# EAGLE design Syno_Ver2.0 (EAGLE 9.5.2)
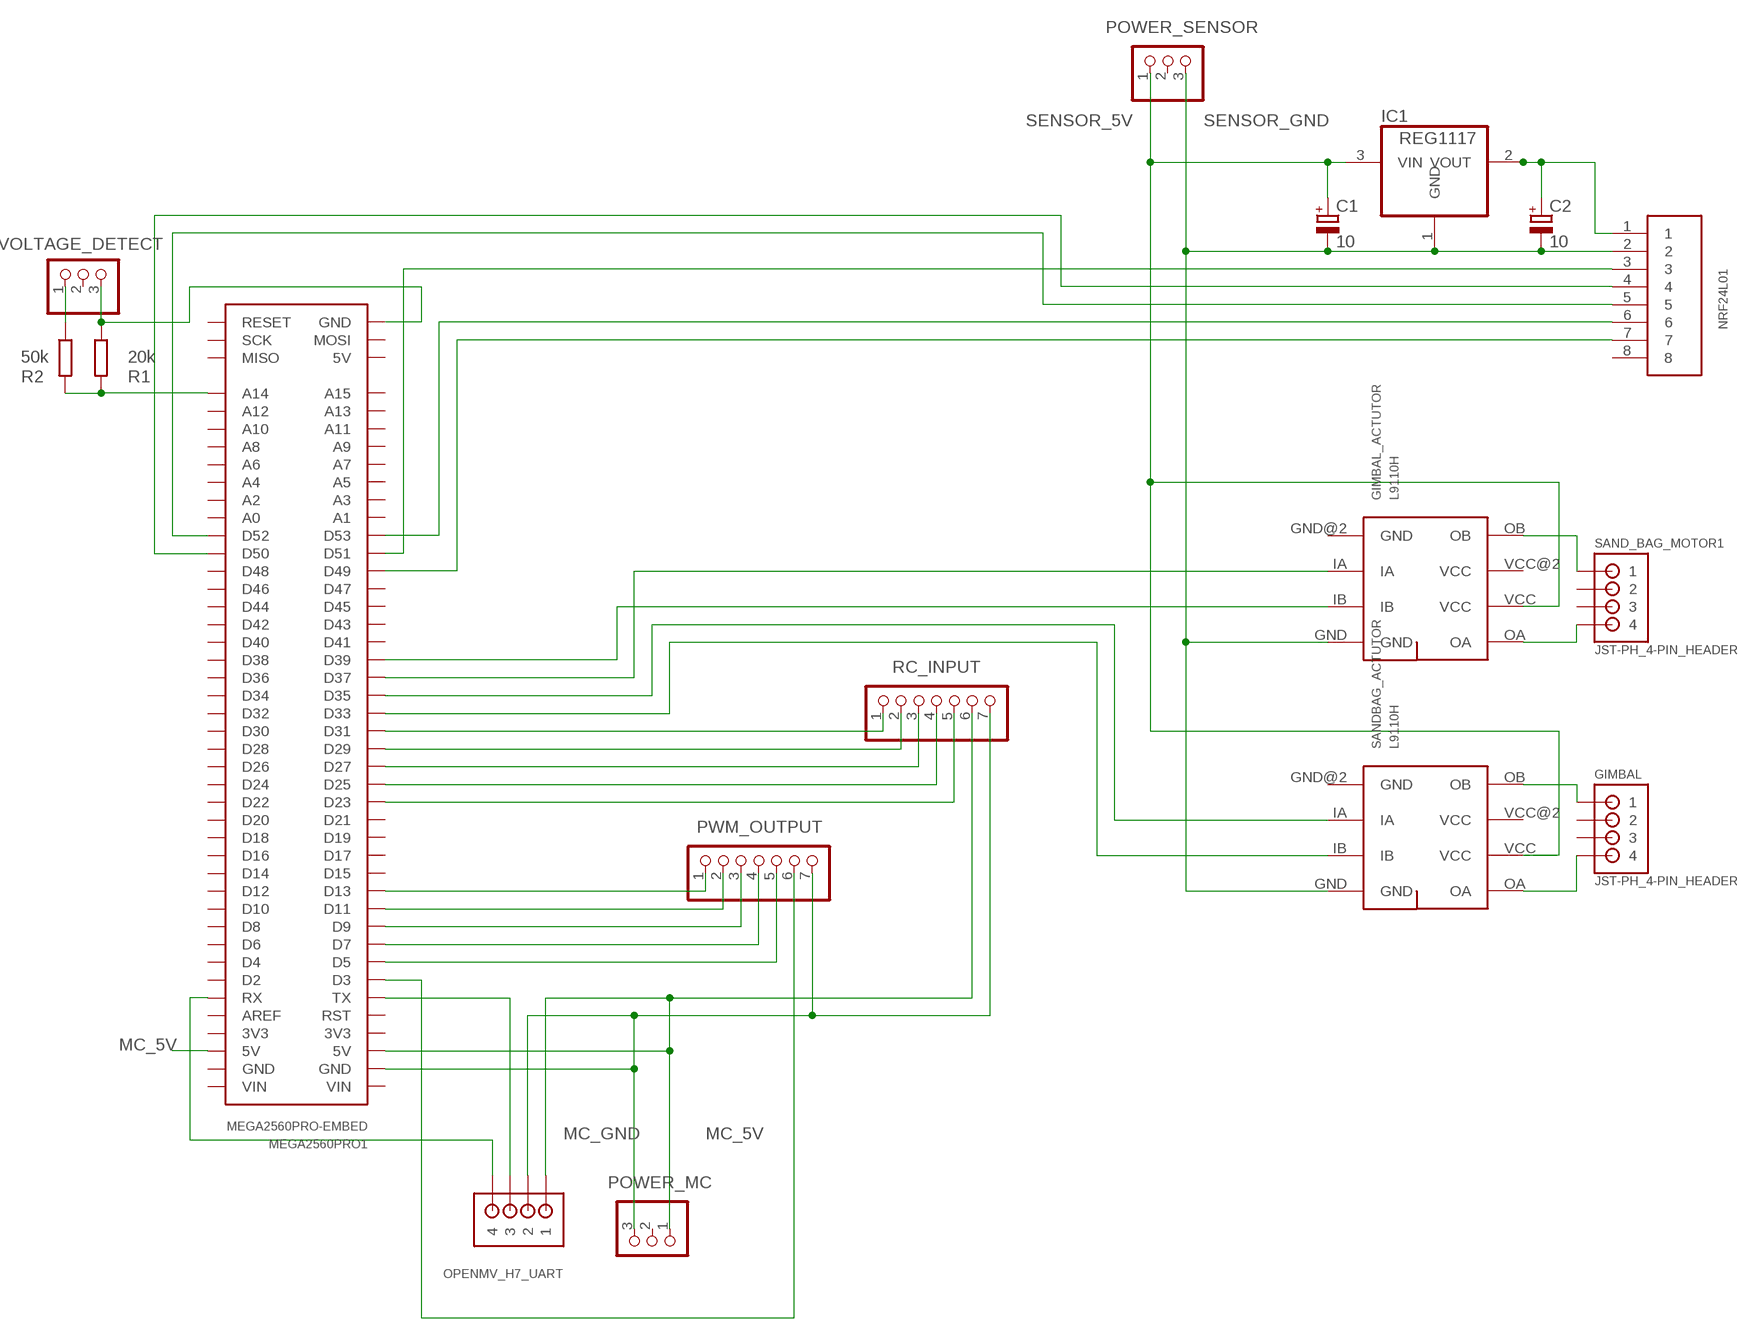
[diagram p0: schematic, sheet 1]

## Parts
C1  10  CPOL-EUE1.8-4  [E1,8-4]
C2  10  CPOL-EUE1.8-4  [E1,8-4]
GIMBAL  JST-PH_4-PIN_HEADER  [JST_B4B-PH_HEADER]
GIMBAL_ACTUTOR  L9110H  [L9110H]
IC1  REG1117  [SOT223]
MEGA2560PRO1  MEGA2560PRO-EMBED  [MEGA2560PRO-EMBED]
NRF24L01  8PIN  [B8B-PH-K-S]
OPENMV_H7_UART  JST-PH_4-PIN_HEADER  [JST_B4B-PH_HEADER]
POWER_MC  PINHD-1X3/90  [1X03/90]
POWER_SENSOR  PINHD-1X3/90  [1X03/90]
PWM_OUTPUT  PINHD-1X7/90  [1X07/90]
R1  20k  R-EU_0204/5  [0204/5]
R2  50k  R-EU_0204/5  [0204/5]
RC_INPUT  PINHD-1X7/90  [1X07/90]
SAND_BAG_MOTOR1  JST-PH_4-PIN_HEADER  [JST_B4B-PH_HEADER]
SANDBAG_ACTUTOR  L9110H  [L9110H]
VOLTAGE_DETECT  PINHD-1X3/90  [1X03/90]

## Nets
MC_5V: MEGA2560PRO1.5V@1(5V) MEGA2560PRO1.5V@2(5V) OPENMV_H7_UART.P1 POWER_MC.1 RC_INPUT.6
MC_GND: MEGA2560PRO1.GND@1(GND) OPENMV_H7_UART.P2 POWER_MC.3 PWM_OUTPUT.7 RC_INPUT.7
N$1: GIMBAL_ACTUTOR.OB SAND_BAG_MOTOR1.P1
N$2: GIMBAL_ACTUTOR.OA SAND_BAG_MOTOR1.P4
N$3: C2.+ IC1.2(VOUT) NRF24L01.1
N$4: GIMBAL.P1 SANDBAG_ACTUTOR.OB
N$5: GIMBAL.P4 SANDBAG_ACTUTOR.OA
N$6: R2.1 VOLTAGE_DETECT.1
N$7: MEGA2560PRO1.A14 R1.2 R2.2
N$8: MEGA2560PRO1.GND@3(GND) R1.1 VOLTAGE_DETECT.3
N$9: MEGA2560PRO1.TX OPENMV_H7_UART.P3
N$10: MEGA2560PRO1.RX OPENMV_H7_UART.P4
N$11: MEGA2560PRO1.D51 NRF24L01.3
N$12: MEGA2560PRO1.D50 NRF24L01.4
N$13: MEGA2560PRO1.D52 NRF24L01.5
N$14: MEGA2560PRO1.D3 PWM_OUTPUT.6
N$15: MEGA2560PRO1.D5 PWM_OUTPUT.5
N$16: MEGA2560PRO1.D7 PWM_OUTPUT.4
N$17: MEGA2560PRO1.D9 PWM_OUTPUT.3
N$18: MEGA2560PRO1.D11 PWM_OUTPUT.2
N$19: MEGA2560PRO1.D13 PWM_OUTPUT.1
N$20: MEGA2560PRO1.D23 RC_INPUT.5
N$21: MEGA2560PRO1.D25 RC_INPUT.4
N$22: MEGA2560PRO1.D27 RC_INPUT.3
N$23: MEGA2560PRO1.D29 RC_INPUT.2
N$24: MEGA2560PRO1.D31 RC_INPUT.1
N$25: MEGA2560PRO1.D53 NRF24L01.6
N$26: MEGA2560PRO1.D49 NRF24L01.7
N$27: GIMBAL_ACTUTOR.IA MEGA2560PRO1.D37
N$28: GIMBAL_ACTUTOR.IB MEGA2560PRO1.D39
N$29: MEGA2560PRO1.D35 SANDBAG_ACTUTOR.IA
N$30: MEGA2560PRO1.D33 SANDBAG_ACTUTOR.IB
SENSOR_5V: C1.+ GIMBAL_ACTUTOR.VCC IC1.3(VIN) POWER_SENSOR.1 SANDBAG_ACTUTOR.VCC
SENSOR_GND: C1.- C2.- GIMBAL_ACTUTOR.GND IC1.1(GND) NRF24L01.2 POWER_SENSOR.3 SANDBAG_ACTUTOR.GND
Unconnected: GIMBAL.P2 GIMBAL.P3 MEGA2560PRO1.3V3@1(3V3) MEGA2560PRO1.3V3@2(3V3) MEGA2560PRO1.5V@3(5V) MEGA2560PRO1.A0 MEGA2560PRO1.A1 MEGA2560PRO1.A2 MEGA2560PRO1.A3 MEGA2560PRO1.A4 MEGA2560PRO1.A5 MEGA2560PRO1.A6 MEGA2560PRO1.A7 MEGA2560PRO1.A8 MEGA2560PRO1.A9 MEGA2560PRO1.A10 MEGA2560PRO1.A11 MEGA2560PRO1.A12 MEGA2560PRO1.A13 MEGA2560PRO1.A15 MEGA2560PRO1.AREF MEGA2560PRO1.D2 MEGA2560PRO1.D4 MEGA2560PRO1.D6 MEGA2560PRO1.D8 MEGA2560PRO1.D10 MEGA2560PRO1.D12 MEGA2560PRO1.D14 MEGA2560PRO1.D15 MEGA2560PRO1.D16 MEGA2560PRO1.D17 MEGA2560PRO1.D18 MEGA2560PRO1.D19 MEGA2560PRO1.D20 MEGA2560PRO1.D21 MEGA2560PRO1.D22 MEGA2560PRO1.D24 MEGA2560PRO1.D26 MEGA2560PRO1.D28 MEGA2560PRO1.D30 MEGA2560PRO1.D32 MEGA2560PRO1.D34 MEGA2560PRO1.D36 MEGA2560PRO1.D38 MEGA2560PRO1.D40 MEGA2560PRO1.D41 MEGA2560PRO1.D42 MEGA2560PRO1.D43 MEGA2560PRO1.D44 MEGA2560PRO1.D45 MEGA2560PRO1.D46 MEGA2560PRO1.D47 MEGA2560PRO1.D48 MEGA2560PRO1.GND@2(GND) MEGA2560PRO1.MISO MEGA2560PRO1.MOSI MEGA2560PRO1.RESET MEGA2560PRO1.RST MEGA2560PRO1.SCK MEGA2560PRO1.VIN@1(VIN) MEGA2560PRO1.VIN@2(VIN) NRF24L01.8 POWER_MC.2 POWER_SENSOR.2 SAND_BAG_MOTOR1.P2 SAND_BAG_MOTOR1.P3 VOLTAGE_DETECT.2

## Power pins joined to a net without a drawn wire
GND: GIMBAL_ACTUTOR.GND@2(GND) SANDBAG_ACTUTOR.GND@2(GND)
VCC: GIMBAL_ACTUTOR.VCC@2(VCC) SANDBAG_ACTUTOR.VCC@2(VCC)

## Library data of the parts
C1 C2 = rcl:CPOL-EU: POLARIZED CAPACITOR, European symbol; SPICEPREFIX: C
GIMBAL OPENMV_H7_UART SAND_BAG_MOTOR1 = srg:JST-PH_4-PIN_HEADER: 4-pin JST PH Shrouded Header, top entry P/N B4B-PH-K-S Mating connector PHR-4 Mating cable assembly: Sparkfun PRT-09916 <http://www.sparkfun.com/products/9916>
GIMBAL_ACTUTOR SANDBAG_ACTUTOR = L9110:L9110H: H bridge ic
IC1 = burr-brown:REG1117: 800mA and 1A Low Dropout (LDO) Positive Regulator 1.8V, 2.5V, 2.85V, 3.3V, 5V, and Adj; MPN: REG1117; OC_FARNELL: 1097566; OC_NEWARK: 14P6981
MEGA2560PRO1 = robotdyn:MEGA2560PRO-EMBED: Robotdyn Robotdyn Mega 2560 PRO (Embed) https://robotdyn.com/mega-2560-pro-embed-ch340g-atmega2560-16au.html
NRF24L01 = jst_eph:8PIN
POWER_MC POWER_SENSOR VOLTAGE_DETECT = pinhead:PINHD-1X3: PIN HEADER
PWM_OUTPUT RC_INPUT = pinhead:PINHD-1X7: PIN HEADER
R1 R2 = rcl:R-EU_: RESISTOR, European symbol; SPICEPREFIX: R

## Board
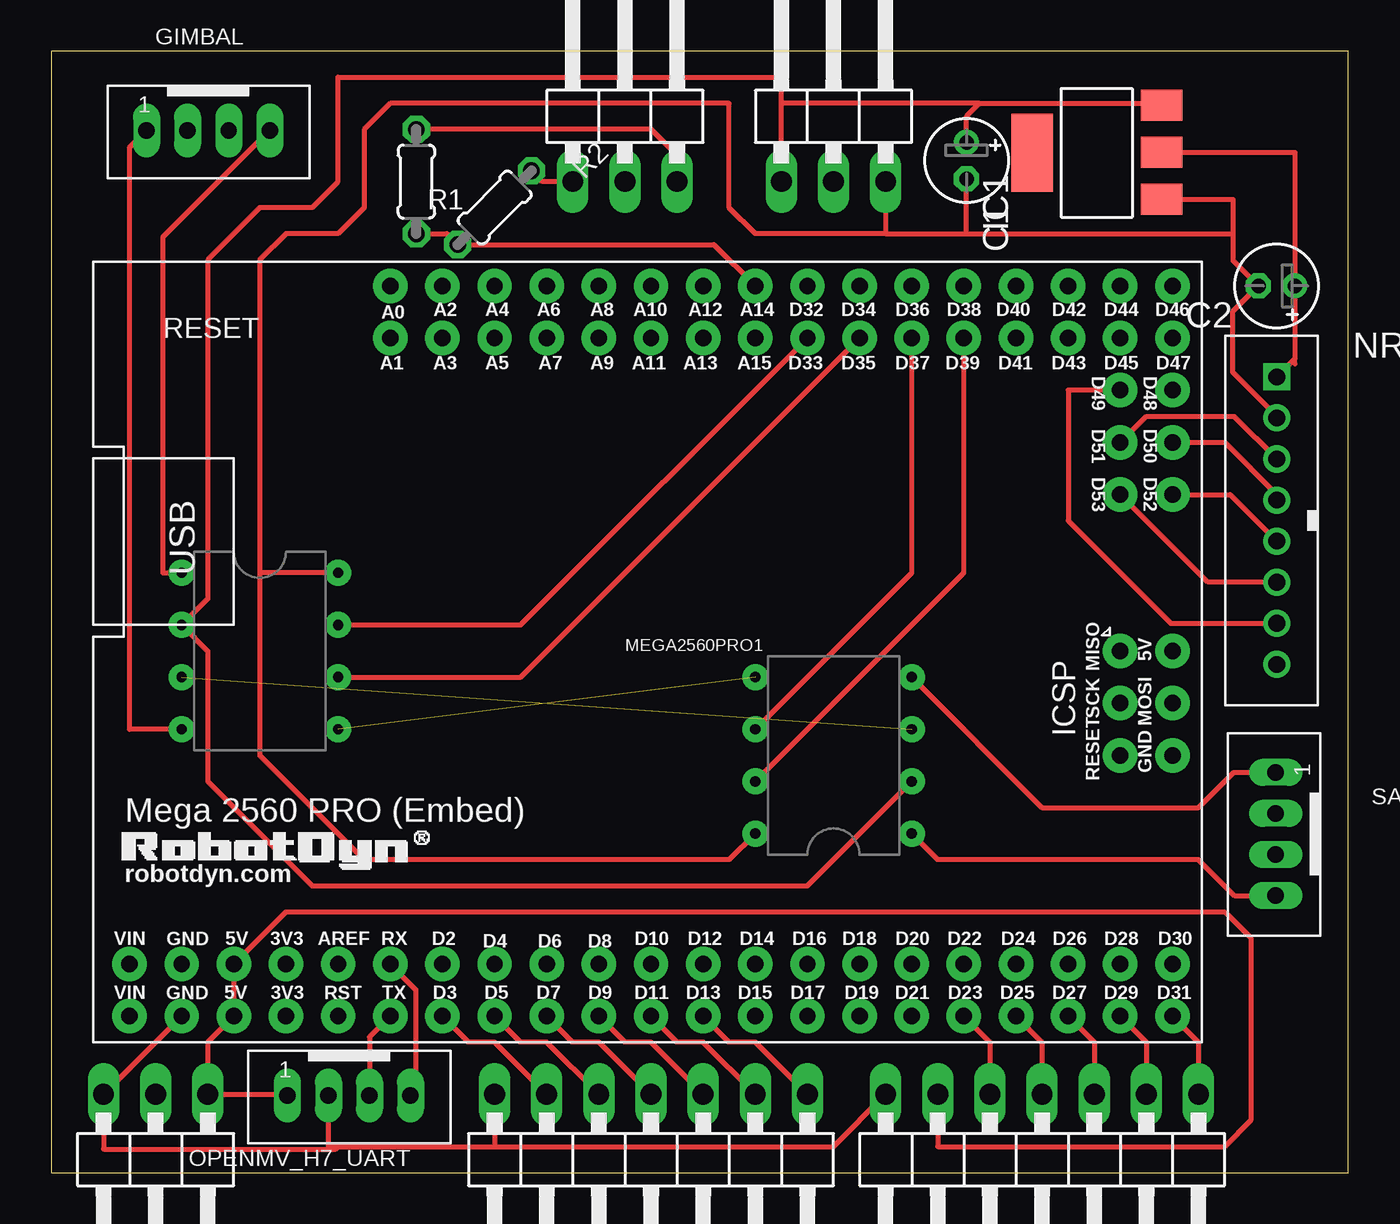
[diagram p1: board, top side]
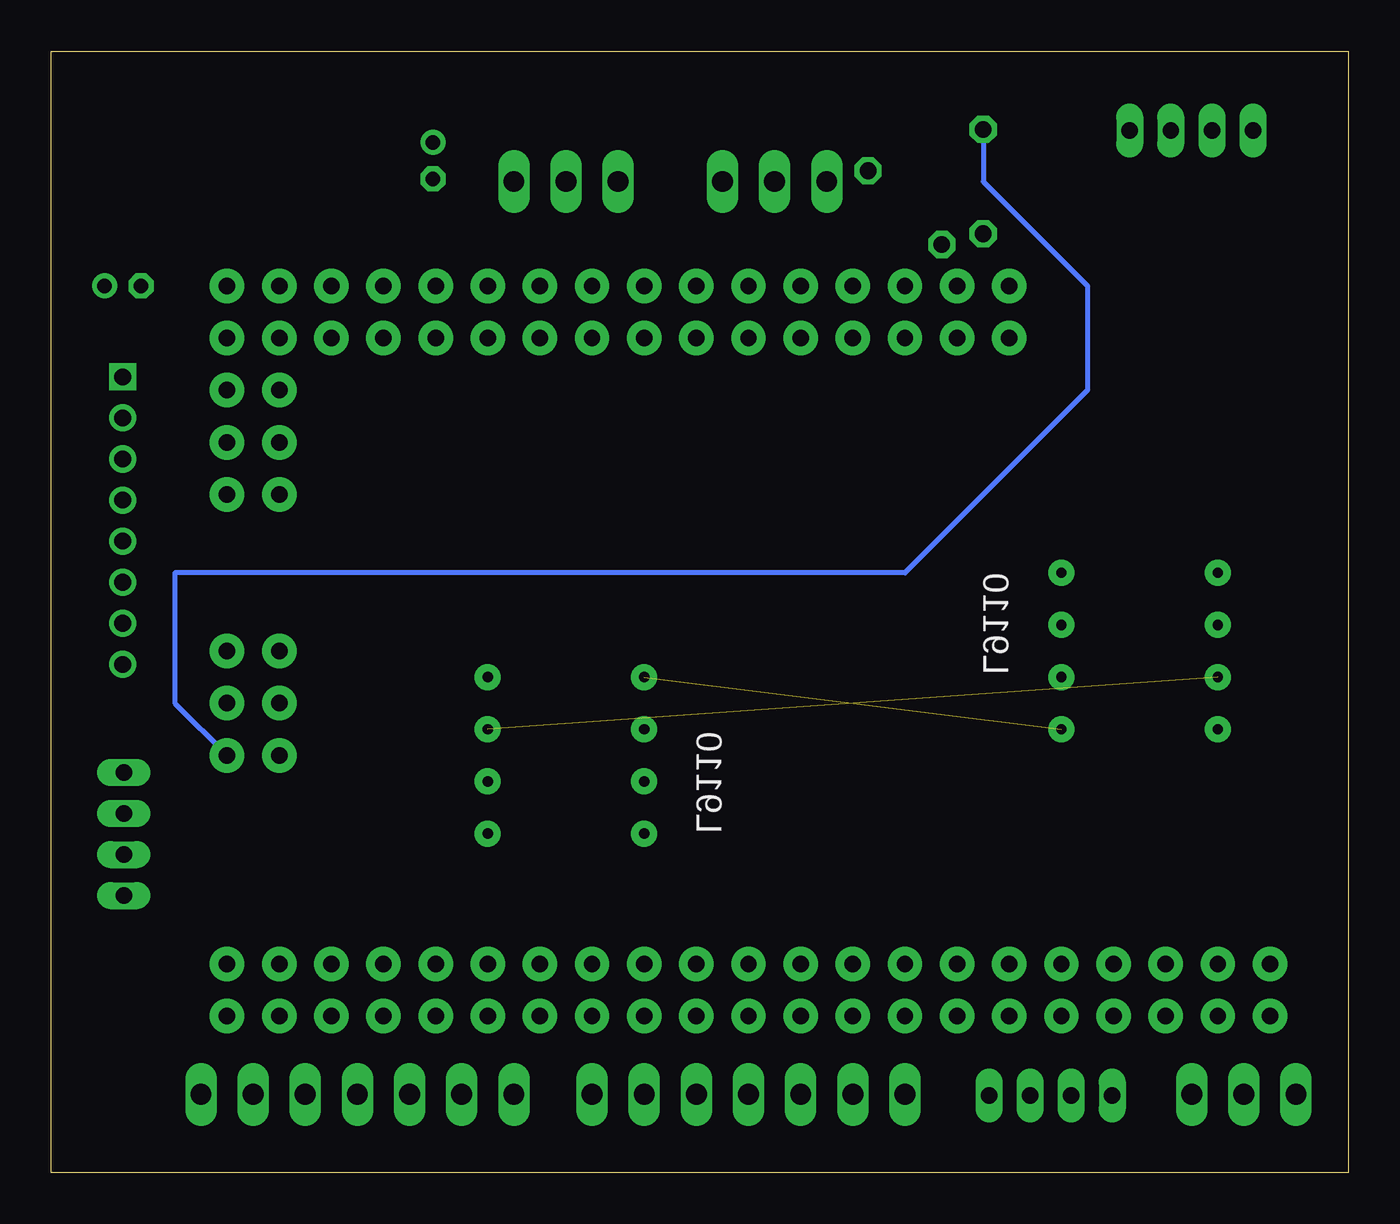
[diagram p2: board, bottom side, seen from below]

Size 63.17 x 54.6 mm. Coordinates in mm from the lower left corner, seen from the top.
Outline: 0,0 63.17,0 63.17,54.6 0,54.6 0,0
Copper layers (1*16): Top 0.035mm / dielectric 1.5mm / Bottom 0.035mm
Design rules "default": minimum track width 6mil, minimum drill 0.35mm, track to track 6mil, track to pad 6mil, pad to pad 6mil, via to via 6mil, smd to smd 6mil, copper to edge 40mil, drill to drill 6mil, minimum pad ring 10mil, minimum via ring 8mil, stop-mask expansion 4mil, vias tented up to drill 0mil, thermal gap 10mil

### Footprints (pad centres in the part's own frame; a part is rotated, then mirrored left to right if it is on the bottom)
E1,8-4 = drill 0.711 pad 1.168: + -0.889,0 | drill 0.711 pad 1.168 octagon: - 0.889,0
JST_B4B-PH_HEADER = drill 0.8 long: P1 2.98,0.048; P2 0.98,0.048; P3 -1.02,0.048; P4 -3.02,0.048
L9110H = drill 0.5 pad 1.27: GND 7.62,7.62; GND@2 7.62,0; IA 7.62,2.54; IB 7.62,5.08; OA 0,7.62; OB 0,0; VCC 0,5.08; VCC@2 0,2.54
SOT223 = smd 1.499 x 2.007: 1 -2.261,-3.15; 2 0.025,-3.15; 3 2.311,-3.15 | smd 3.81 x 2.007: 4 0,3.15
MEGA2560PRO-EMBED = drill 0.8 pad 1.676: 3V3@1 -25.4,-19.05; 3V3@2 -25.4,-16.51; 5V@1 -27.94,-19.05; 5V@2 -27.94,-16.51; 5V@3 17.78,-1.27; A0 -20.32,16.51; A1 -20.32,13.97; A2 -17.78,16.51; A3 -17.78,13.97; A4 -15.24,16.51; A5 -15.24,13.97; A6 -12.7,16.51; A7 -12.7,13.97; A8 -10.16,16.51; A9 -10.16,13.97; A10 -7.62,16.51; A11 -7.62,13.97; A12 -5.08,16.51; A13 -5.08,13.97; A14 -2.54,16.51; A15 -2.54,13.97; AREF -22.86,-16.51; D2 -17.78,-16.51; D3 -17.78,-19.05; D4 -15.24,-16.51; D5 -15.24,-19.05; D6 -12.7,-16.51; D7 -12.7,-19.05; D8 -10.16,-16.51; D9 -10.16,-19.05; D10 -7.62,-16.51; D11 -7.62,-19.05; D12 -5.08,-16.51; D13 -5.08,-19.05; D14 -2.54,-16.51; D15 -2.54,-19.05; D16 0,-16.51; D17 0,-19.05; D18 2.54,-16.51; D19 2.54,-19.05; D20 5.08,-16.51; D21 5.08,-19.05; D22 7.62,-16.51; D23 7.62,-19.05; D24 10.16,-16.51; D25 10.16,-19.05; D26 12.7,-16.51; D27 12.7,-19.05; D28 15.24,-16.51; D29 15.24,-19.05; D30 17.78,-16.51; D31 17.78,-19.05; D32 0,16.51; D33 0,13.97; D34 2.54,16.51; D35 2.54,13.97; D36 5.08,16.51; D37 5.08,13.97; D38 7.62,16.51; D39 7.62,13.97; D40 10.16,16.51; D41 10.16,13.97; D42 12.7,16.51; D43 12.7,13.97; D44 15.24,16.51; D45 15.24,13.97; D46 17.78,16.51; D47 17.78,13.97; D48 17.78,11.43; D49 15.24,11.43; D50 17.78,8.89; D51 15.24,8.89; D52 17.78,6.35; D53 15.24,6.35; GND@1 -30.48,-19.05; GND@2 -30.48,-16.51; GND@3 17.78,-6.35; MISO 15.24,-1.27; MOSI 17.78,-3.81; RESET 15.24,-6.35; RST -22.86,-19.05; RX -20.32,-16.51; SCK 15.24,-3.81; TX -20.32,-19.05; VIN@1 -33.02,-19.05; VIN@2 -33.02,-16.51
B8B-PH-K-S = drill 0.813 square: 1 7,0 | drill 0.813: 2 5,0; 3 3,0; 4 1,0; 5 -1,0; 6 -3,0; 7 -5,0; 8 -7,0
1X03/90 = drill 1.016 long: 1 -2.54,-3.81; 2 0,-3.81; 3 2.54,-3.81
1X07/90 = drill 1.016 long: 1 -7.62,-3.81; 2 -5.08,-3.81; 3 -2.54,-3.81; 4 0,-3.81; 5 2.54,-3.81; 6 5.08,-3.81; 7 7.62,-3.81
0204/5 = drill 0.813 octagon: 1 -2.54,0; 2 2.54,0

### Placement (x,y rotation side)
C1  44.58,49.28 270 top
C2  59.69,43.18 180 top
GIMBAL  7.62,50.8 180 top
GIMBAL_ACTUTOR  41.91,24.13 180 top
IC1  50.93,49.66 90 top
MEGA2560PRO1  36.83,26.67 0 top
NRF24L01  59.69,31.75 90 top
OPENMV_H7_UART  14.48,3.81 180 top
POWER_MC  5.08,0 180 top
POWER_SENSOR  38.1,52.07 0 top
PWM_OUTPUT  29.21,0 180 top
R1  17.78,48.26 270 top
R2  21.59,46.99 225 top
RC_INPUT  48.26,0 180 top
SAND_BAG_MOTOR1  59.69,16.51 90 top
SANDBAG_ACTUTOR  6.35,21.59 0 top
VOLTAGE_DETECT  27.94,52.07 0 top

### Tracks (layer width: path | path; a pad name or v marks a point on that pad's centre or on a via)
GND  (1 unrouted)
MC_5V
  Top 0.254: OPENMV_H7_UART.P1 11.45,3.81 POWER_MC.1 7.62,6.35 MEGA2560PRO1.5V@1 MEGA2560PRO1.5V@2 11.43,12.7 54.61,12.7 55.88,12.7 57.15,12.7 58.42,11.43 58.42,2.54 57.15,1.27 43.18,1.27 RC_INPUT.6
MC_GND
  Top 0.254: MEGA2560PRO1.GND@1 POWER_MC.3 2.54,1.14 13.84,1.14 13.97,1.27 | OPENMV_H7_UART.P2 13.5,1.27 13.97,1.27 | 13.97,1.27 21.59,1.27 | PWM_OUTPUT.7 21.59,1.27 | 21.59,1.27 38.1,1.27 RC_INPUT.7
N$1
  Top 0.254: SAND_BAG_MOTOR1.P1 57.59,19.49 55.88,17.78 48.26,17.78 GIMBAL_ACTUTOR.OB
N$2
  Top 0.254: GIMBAL_ACTUTOR.OA 43.18,15.24 55.88,15.24 57.63,13.49 SAND_BAG_MOTOR1.P4
N$3
  Top 0.254: NRF24L01.1 60.58,39.64 | 60.58,39.64 C2.+ 60.58,49.68 IC1.2 | 60.58,39.37 60.58,39.64
N$4
  Top 0.254: SANDBAG_ACTUTOR.OB 3.81,21.59 3.81,49.92 GIMBAL.P1
N$5
  Top 0.254: GIMBAL.P4 5.44,45.55 5.44,29.21 SANDBAG_ACTUTOR.OA
N$6
  Top 0.254: VOLTAGE_DETECT.1 23.91,48.26 R2.1
N$7
  Top 0.254: MEGA2560PRO1.A14 | R1.2 19.27,45.72 R2.2 32.28,45.19 MEGA2560PRO1.A14
N$8
  Top 0.254: R1.1 29.21,50.8 30.48,49.53 VOLTAGE_DETECT.3
  Bottom 0.254: R1.1 17.78,48.26 12.7,43.18 12.7,38.1 21.59,29.21 57.15,29.21 57.15,22.86 MEGA2560PRO1.GND@3
N$9
  Top 0.254: MEGA2560PRO1.TX 15.5,6.61 OPENMV_H7_UART.P3
N$10
  Top 0.254: OPENMV_H7_UART.P4 17.5,3.48 17.75,3.22 17.75,8.91 MEGA2560PRO1.RX
N$11
  Top 0.254: MEGA2560PRO1.D51 53.34,36.83 57.61,36.83 NRF24L01.3
N$12
  Top 0.254: MEGA2560PRO1.D50 57.15,35.56 59.69,33.02 NRF24L01.4
N$13
  Top 0.254: NRF24L01.5 57.42,33.02 MEGA2560PRO1.D52
N$14
  Top 0.254: PWM_OUTPUT.6 21.59,6.35 20.32,6.35 MEGA2560PRO1.D3
N$15
  Top 0.254: PWM_OUTPUT.5 24.13,6.35 22.86,6.35 MEGA2560PRO1.D5
N$16
  Top 0.254: PWM_OUTPUT.4 26.67,6.35 25.4,6.35 MEGA2560PRO1.D7
N$17
  Top 0.254: PWM_OUTPUT.3 29.21,6.35 27.94,6.35 MEGA2560PRO1.D9
N$18
  Top 0.254: PWM_OUTPUT.2 31.75,6.35 30.48,6.35 MEGA2560PRO1.D11
N$19
  Top 0.254: PWM_OUTPUT.1 34.29,6.35 33.02,6.35 MEGA2560PRO1.D13
N$20
  Top 0.254: MEGA2560PRO1.D23 45.72,6.35 RC_INPUT.5
N$21
  Top 0.254: MEGA2560PRO1.D25 48.26,6.35 RC_INPUT.4
N$22
  Top 0.254: MEGA2560PRO1.D27 50.8,6.35 RC_INPUT.3
N$23
  Top 0.254: MEGA2560PRO1.D29 53.34,6.35 RC_INPUT.2
N$24
  Top 0.254: MEGA2560PRO1.D31 55.88,6.35 RC_INPUT.1
N$25
  Top 0.254: NRF24L01.6 56.34,28.75 MEGA2560PRO1.D53
N$26
  Top 0.254: MEGA2560PRO1.D49 49.53,38.1 49.53,31.75 54.53,26.75 NRF24L01.7
N$27
  Top 0.254: MEGA2560PRO1.D37 41.91,29.21 GIMBAL_ACTUTOR.IA
N$28
  Top 0.254: MEGA2560PRO1.D39 44.45,29.21 GIMBAL_ACTUTOR.IB
N$29
  Top 0.254: SANDBAG_ACTUTOR.IA 22.86,24.13 MEGA2560PRO1.D35
N$30
  Top 0.254: SANDBAG_ACTUTOR.IB 22.86,26.67 MEGA2560PRO1.D33
SENSOR_5V
  Top 0.254: POWER_SENSOR.1 35.56,52.07 | 35.56,52.07 35.56,53.34 13.97,53.34 13.97,48.26 12.7,46.99 10.16,46.99 7.62,44.45 7.62,27.94 SANDBAG_ACTUTOR.VCC 7.62,25.4 7.62,19.05 12.7,13.97 36.83,13.97 GIMBAL_ACTUTOR.VCC | 45.21,52.07 44.58,51.44 C1.+ | 45.21,52.07 35.56,52.07 | 45.21,52.07 54.08,52.07 IC1.3
SENSOR_GND
  Top 0.254: NRF24L01.2 59.69,36.83 57.53,38.99 57.53,41.91 C2.- 57.56,44.42 57.56,45.72 | 57.56,45.72 57.56,47.4 IC1.1 | 40.64,47.12 POWER_SENSOR.3 40.64,45.72 | 40.64,45.72 44.58,45.72 | 44.58,45.72 C1.- | 44.58,45.72 57.56,45.72 | 10.16,29.21 10.16,44.45 11.43,45.72 13.97,45.72 15.24,46.99 15.24,50.8 16.51,52.07 33.02,52.07 33.02,46.99 34.29,45.72 40.64,45.72 | SANDBAG_ACTUTOR.GND 10.16,29.21 | 10.16,29.21 10.16,20.32 15.24,15.24 33.02,15.24 GIMBAL_ACTUTOR.GND
VCC  (1 unrouted)